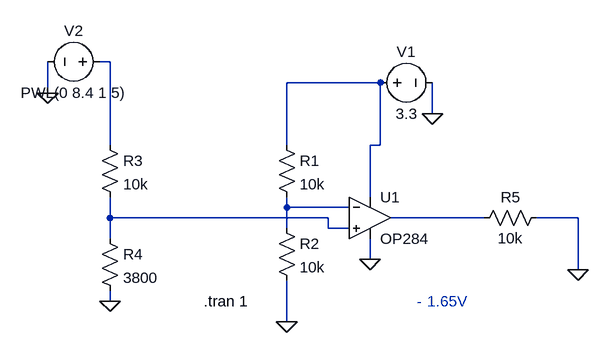
[diagram p0: schematic Low battery indication.asc]
Low battery indication.asc, the LTspice schematic file:
Version 4
SHEET 1 880 680
WIRE -144 -80 -160 -80
WIRE 272 -48 128 -48
WIRE -240 -32 -240 -80
WIRE 352 0 352 -48
WIRE -144 48 -144 -80
WIRE 128 48 128 -48
WIRE 272 48 272 -48
WIRE 272 48 256 48
WIRE 256 128 256 48
WIRE 128 144 128 128
WIRE 224 144 128 144
WIRE -144 160 -144 128
WIRE 192 160 -144 160
WIRE 432 160 288 160
WIRE 576 160 512 160
WIRE 128 176 128 144
WIRE 192 176 192 160
WIRE 224 176 192 176
WIRE -144 192 -144 160
WIRE 256 224 256 192
WIRE 576 240 576 160
WIRE -144 288 -144 272
WIRE 128 320 128 256
FLAG 256 224 0
FLAG 352 0 0
FLAG 128 320 0
FLAG -144 288 0
FLAG -240 -32 0
FLAG 576 240 0
SYMBOL voltage 256 -48 R270
WINDOW 0 32 56 VTop 2
WINDOW 3 -32 56 VBottom 2
WINDOW 123 0 0 Left 0
WINDOW 39 0 0 Left 0
SYMATTR InstName V1
SYMATTR Value 3.3
SYMBOL res 112 32 R0
SYMATTR InstName R1
SYMATTR Value 10k
SYMBOL res 112 160 R0
SYMATTR InstName R2
SYMATTR Value 10k
SYMBOL res -160 32 R0
SYMATTR InstName R3
SYMATTR Value 10k
SYMBOL res -160 176 R0
SYMATTR InstName R4
SYMATTR Value 3800
SYMBOL voltage -144 -80 R90
WINDOW 0 -32 56 VBottom 2
WINDOW 3 32 56 VTop 2
WINDOW 123 0 0 Left 0
WINDOW 39 0 0 Left 0
SYMATTR InstName V2
SYMATTR Value PWL(0 8.4 1 5)
SYMBOL res 528 144 R90
WINDOW 0 0 56 VBottom 2
WINDOW 3 32 56 VTop 2
SYMATTR InstName R5
SYMATTR Value 10k
SYMBOL OpAmps\\OP284 256 96 R0
SYMATTR InstName U1
TEXT 344 288 Left 2 ;1.65V
TEXT 328 288 Left 2 ;-
TEXT 0 288 Left 2 !.tran 1

The netlist it stands for:
* Low battery indication.asc
V1 N002 0 3.3
R1 N002 N003 10k
R2 N003 0 10k
R3 N001 N004 10k
R4 N004 0 3800
V2 N001 0 PWL(0 8.4 1 5)
R5 0 N005 10k
XU1 N004 N003 N002 0 N005 OP284  ; pins In+ In- V+ V- OUT
* 1.65V
* -
.tran 1
.lib ADI1.lib
.backanno
.end